# EAGLE design DeviceDIn8DOut8 (EAGLE 5.00)
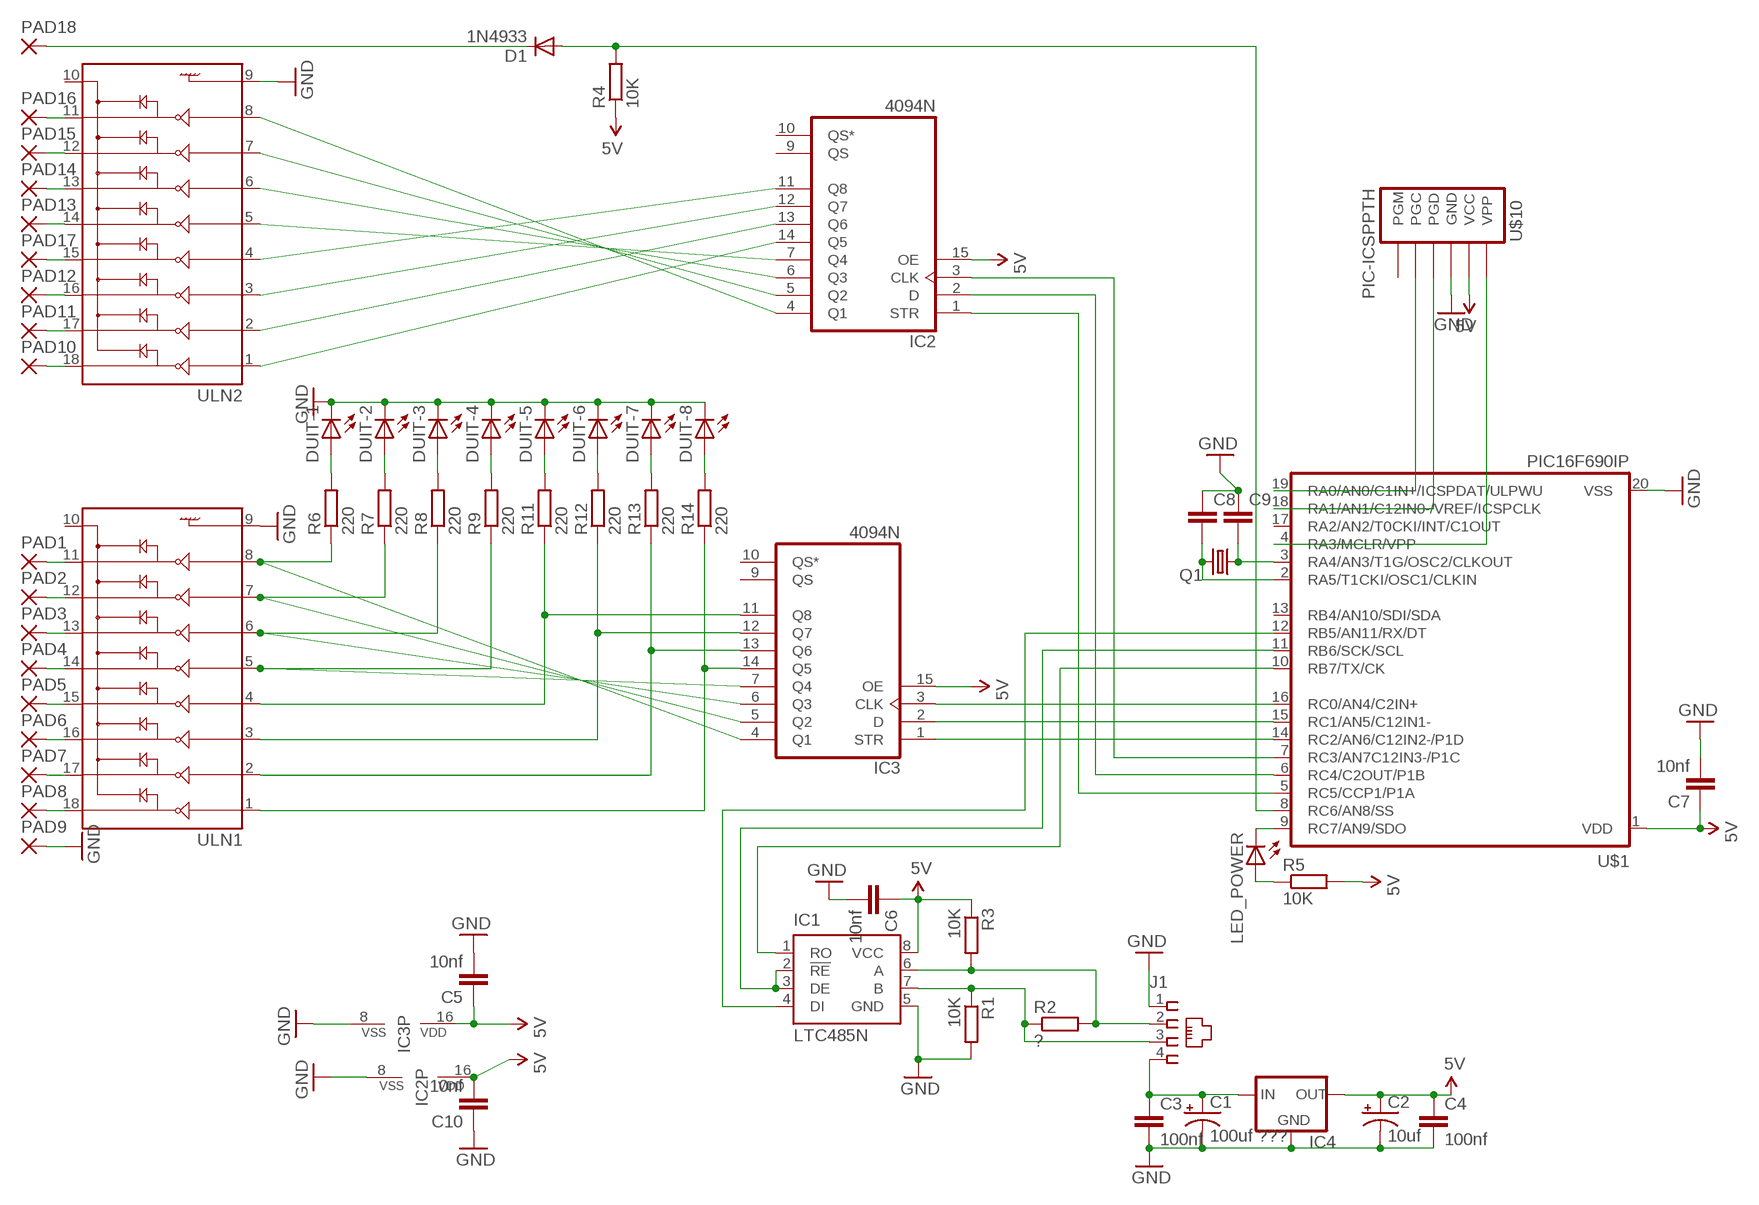
[diagram p0: schematic, sheet 1]

## Parts
C1  100uf ???  CAP_POLPTH1  [CPOL-RADIAL-100UF-25V]
C2  10uf  CAP_POLPTH1  [CPOL-RADIAL-100UF-25V]
C3  100nf  C2.5/2  [C2.5-2]
C4  100nf  C5/2.5  [C5B2.5]
C5  10nf  C5/3  [C5B3]
C6  10nf  C5/3  [C5B3]
C7  10nf  C2.5/2  [C2.5-2]
C8  C5/3  [C5B3]
C9  C5/3  [C5B3]
C10  10nf  C2.5/2  [C2.5-2]
D1  1N4933  [DO41-10]
DUIT-1  LED5MM  [LED5MM]
DUIT-2  LED5MM  [LED5MM]
DUIT-3  LED5MM  [LED5MM]
DUIT-4  LED5MM  [LED5MM]
DUIT-5  LED5MM  [LED5MM]
DUIT-6  LED5MM  [LED5MM]
DUIT-7  LED5MM  [LED5MM]
DUIT-8  LED5MM  [LED5MM]
IC1  LTC485N  [DIL08]
IC2  4094N  [DIL16]
IC3  4094N  [DIL16]
IC4  78XXS  [78XXS]
J1  215875-3  [215875-3]
LED_POWER  LED5MM  [LED5MM]
PAD1  2,15/1,0  [2,15/1,0]
PAD2  2,15/1,0  [2,15/1,0]
PAD3  2,15/1,0  [2,15/1,0]
PAD4  2,15/1,0  [2,15/1,0]
PAD5  2,15/1,0  [2,15/1,0]
PAD6  2,15/1,0  [2,15/1,0]
PAD7  2,15/1,0  [2,15/1,0]
PAD8  2,15/1,0  [2,15/1,0]
PAD9  2,15/1,0  [2,15/1,0]
PAD10  2,15/1,0  [2,15/1,0]
PAD11  2,15/1,0  [2,15/1,0]
PAD12  2,15/1,0  [2,15/1,0]
PAD13  2,15/1,0  [2,15/1,0]
PAD14  2,15/1,0  [2,15/1,0]
PAD15  2,15/1,0  [2,15/1,0]
PAD16  2,15/1,0  [2,15/1,0]
PAD17  2,15/1,0  [2,15/1,0]
PAD18  2,15/1,0  [2,15/1,0]
Q1  CRYSTALHC49S  [HC49/S]
R1  10K  R-EU_0204/5  [0204/5]
R2  ?  R-EU_0204/5  [0204/5]
R3  10K  R-EU_0204/5  [0204/5]
R4  10K  R-EU_0204/5  [0204/5]
R5  10K  R-EU_0204/5  [0204/5]
R6  220  R-EU_0204/7  [0204/7]
R7  220  R-EU_0204/7  [0204/7]
R8  220  R-EU_0204/7  [0204/7]
R9  220  R-EU_0204/7  [0204/7]
R11  220  R-EU_0204/7  [0204/7]
R12  220  R-EU_0204/7  [0204/7]
R13  220  R-EU_0204/7  [0204/7]
R14  220  R-EU_0204/7  [0204/7]
U$1  PIC16F690IP  [DIL20]
U$10  PIC-ICSPPTH  [MOLEX-1X6]
ULN1  ULN2803DIP  [DIL18]
ULN2  ULN2803DIP  [DIL18]

## Nets
5V: C2.1(+) C4.1 C5.1 C6.1 C7.1 C10.2 IC1.8(VCC) IC2.15(OE) IC2.16(VDD) IC3.15(OE) IC3.16(VDD) IC4.OUT R3.1 R4.1 R5.2 U$1.1(VDD) U$10.5(VCC)
GND: C1.2(-) C2.2(-) C3.2 C4.2 C5.2 C6.2 C7.2 C8.1 C9.1 C10.1 DUIT-1.K(C) DUIT-2.K(C) DUIT-3.K(C) DUIT-4.K(C) DUIT-5.K(C) DUIT-6.K(C) DUIT-7.K(C) DUIT-8.K(C) IC1.5(GND) IC2.8(VSS) IC3.8(VSS) IC4.GND J1.1 PAD9.1(P) R1.2 U$1.20(VSS) U$10.4(GND) ULN1.9 ULN2.9
N$1: PAD1.1(P) ULN1.11
N$2: PAD2.1(P) ULN1.12
N$3: PAD3.1(P) ULN1.13
N$4: PAD4.1(P) ULN1.14
N$5: PAD5.1(P) ULN1.15
N$6: PAD6.1(P) ULN1.16
N$7: PAD8.1(P) ULN1.18
N$8: PAD7.1(P) ULN1.17
N$9: D1.A R4.2 U$1.8(RC6/AN8/SS)
N$10: IC3.7(Q4) R9.1 ULN1.5
N$11: IC1.6(A) J1.2 R2.2 R3.2
N$12: IC3.6(Q3) R8.1 ULN1.6
N$13: IC3.5(Q2) R7.1 ULN1.7
N$14: IC3.4(Q1) R6.1 ULN1.8
N$15: IC3.14(Q5) R14.1 ULN1.1
N$16: IC3.13(Q6) R13.1 ULN1.2
N$17: IC3.12(Q7) R12.1 ULN1.3
N$18: IC3.11(Q8) R11.1 ULN1.4
N$19: IC2.3(CLK) U$1.7(RC3/AN7C12IN3-/P1C)
N$20: IC2.2(D) U$1.6(RC4/C2OUT/P1B)
N$21: IC2.1(STR) U$1.5(RC5/CCP1/P1A)
N$23: IC2.14(Q5) ULN2.1
N$24: IC2.13(Q6) ULN2.2
N$25: IC1.2(!RE) IC1.3(DE) U$1.11(RB6/SCK/SCL)
N$26: IC2.12(Q7) ULN2.3
N$27: IC2.11(Q8) ULN2.4
N$28: IC2.7(Q4) ULN2.5
N$29: IC2.6(Q3) ULN2.6
N$30: IC2.5(Q2) ULN2.7
N$31: IC2.4(Q1) ULN2.8
N$32: D1.C PAD18.1(P)
N$33: PAD11.1(P) ULN2.17
N$34: PAD16.1(P) ULN2.11
N$35: PAD15.1(P) ULN2.12
N$36: PAD14.1(P) ULN2.13
N$37: PAD13.1(P) ULN2.14
N$38: PAD17.1(P) ULN2.15
N$39: PAD12.1(P) ULN2.16
N$40: PAD10.1(P) ULN2.18
N$41: LED_POWER.K(C) U$1.9(RC7/AN9/SDO)
N$42: LED_POWER.A R5.1
N$43: DUIT-4.A R9.2
N$44: DUIT-5.A R11.2
N$45: DUIT-1.A R6.2
N$46: C1.1(+) C3.1 IC4.IN J1.4
N$47: IC3.2(D) U$1.15(RC1/AN5/C12IN1-)
N$48: IC3.1(STR) U$1.14(RC2/AN6/C12IN2-/P1D)
N$49: IC1.4(DI) U$1.12(RB5/AN11/RX/DT)
N$50: IC1.7(B) J1.3 R1.1 R2.1
N$51: IC1.1(RO) U$1.10(RB7/TX/CK)
N$52: C8.2 Q1.2 U$1.2(RA5/T1CKI/OSC1/CLKIN)
N$53: C9.2 Q1.1 U$1.3(RA4/AN3/T1G/OSC2/CLKOUT)
N$55: DUIT-2.A R7.2
N$56: DUIT-3.A R8.2
N$57: DUIT-6.A R12.2
N$58: DUIT-7.A R13.2
N$59: DUIT-8.A R14.2
N$60: IC3.3(CLK) U$1.16(RC0/AN4/C2IN+)
N$61: U$1.4(RA3/MCLR/VPP) U$10.6(VPP)
N$62: U$1.18(RA1/AN1/C12IN0-/VREF/ICSPCLK) U$10.3(PGD)
N$63: U$1.19(RA0/AN0/C1IN+/ICSPDAT/ULPWU) U$10.2(PGC)
Unconnected: IC2.9(QS) IC2.10(QS*) IC3.9(QS) IC3.10(QS*) U$1.13(RB4/AN10/SDI/SDA) U$1.17(RA2/AN2/T0CKI/INT/C1OUT) U$10.1(PGM) ULN1.10 ULN2.10

## Library data of the parts
C1 C2 = SparkFun:CAP_POL: Capacitor Polarized These are standard SMD and PTH capacitors. Normally 10uF, 47uF, and 100uF in electrolytic and tantalum varieties. Always verify the external diameter of the through hole cap, it varies with capacity, voltage, and manufacturer. The EIA devices should be standard.
C3-C10 = capacitor-wima:C: CAPACITOR naming: grid - package width
D1 = diode:1N4933: DIODE fast recovery rectifier, 1A
DUIT-1-DUIT-8 LED_POWER = led:LED: LED OSRAM: - CHIPLED LG R971, LG N971, LY N971, LG Q971, LY Q971, LO R971, LY R971 LH N974, LH R974 LS Q976, LO Q976, LY Q976 LO Q996 - Hyper CHIPLED LW Q18S LB Q993, LB Q99A, LB R99A - SideLED LS A670, LO A670, LY A670, LG A670, LP A670 LB A673, LV A673, LT A673, LW A673 LH A674 LY A675 LS A676, LA A676, LO A676, LY A676, LW A676 LS A679, LY A679, LG A679 - Hyper Micro SIDELED® LS Y876, LA Y876, LO Y876, LY Y876 LT Y87S - SmartLED LW L88C, LW L88S LB L89C, LB L89S, LG L890 LS L89K, LO L89K, LY L89K LS L896, LA L896, LO L896, LY L896 - TOPLED LS T670, LO T670, LY T670, LG T670, LP T670 LSG T670, LSP T670, LSY T670, LOP T670, LYG T670 LG T671, LOG T671, LSG T671 LB T673, LV T673, LT T673, LW T673 LH T674 LS T676, LA T676, LO T676, LY T676, LB T676, LH T676, LSB T676, LW T676 LB T67C, LV T67C, LT T67C, LS T67K, LO T67K, LY T67K, LW E67C LS E67B, LA E67B, LO E67B, LY E67B, LB E67C, LV E67C, LT E67C LW T67C LS T679, LY T679, LG T679 LS T770, LO T770, LY T770, LG T770, LP T770 LB T773, LV T773, LT T773, LW T773 LH T774 LS E675, LA E675, LY E675, LS T675 LS T776, LA T776, LO T776, LY T776, LB T776 LHGB T686 LT T68C, LB T68C - Hyper Mini TOPLED® LB M676 - Mini TOPLED Santana® LG M470 LS M47K, LO M47K, LY M47K Source: http://www.osram.convergy.de LUXEON: - LUMILED® LXK2-PW12-R00, LXK2-PW12-S00, LXK2-PW14-U00, LXK2-PW14-V00 LXK2-PM12-R00, LXK2-PM12-S00, LXK2-PM14-U00 LXK2-PE12-Q00, LXK2-PE12-R00, LXK2-PE12-S00, LXK2-PE14-T00, LXK2-PE14-U00 LXK2-PB12-K00, LXK2-PB12-L00, LXK2-PB12-M00, LXK2-PB14-N00, LXK2-PB14-P00, LXK2-PB14-Q00 LXK2-PR12-L00, LXK2-PR12-M00, LXK2-PR14-Q00, LXK2-PR14-R00 LXK2-PD12-Q00, LXK2-PD12-R00, LXK2-PD12-S00 LXK2-PH12-R00, LXK2-PH12-S00 LXK2-PL12-P00, LXK2-PL12-Q00, LXK2-PL12-R00 Source: www.luxeon.com KINGBRIGHT: KA-3528ASYC Source: www.kingbright.com
IC1 = linear-technology:LTC485: Low Power RS485 Interface Transceiver Source: http://www.linear.com/pc/downloadDocument.do?navId=H0,C1,C1007,C1017,P2064,D1718
IC2 IC3 = 40xx:4094: 8-stage SHIFT/STORE REGISTER, tri-state
IC4 = v-reg:78XXS: VOLTAGE REGULATOR
J1 = con-amp:215875-3: AMP connector
PAD1-PAD18 = wirepad:2,15/1,0: THROUGH-HOLE PAD
Q1 = crystal:CRYSTAL: CRYSTAL
R1-R5 = resistor:R-EU_: RESISTOR, European symbol
R6-R9 R11-R14 = rcl:R-EU_: RESISTOR, European symbol
U$1 = microchip-5:PIC16F690*: MICROCONTROLLER PIC16F690 18 I/O One 16-bit timer Two 8-bit timer Two comparators Precision internal oscillator-software selectable 8 MHz - 32 KHz SSP w/ I2C Compatible Address mask option EUSART LIN 2.0 Compatible ECCP+ w/ PWM Steering 12 A/D Channels ULPW Enhanced Low Power Timer 1 Timer 1 Gate Synch Latch 4k Program Flash memory 256 bytes SRAM 256 bytes EEPROM
U$10 = SparkFun:PIC-ICSP: ISCP Programming connector for UAV, UBW Kit, etc.
ULN1 ULN2 = SparkFun:ULN2803: Darlington Driver ULN2803 Darlington array. 500mA max per channel, 8-channel package. Spark Fun Electronics SKU : COM-00312

## Board
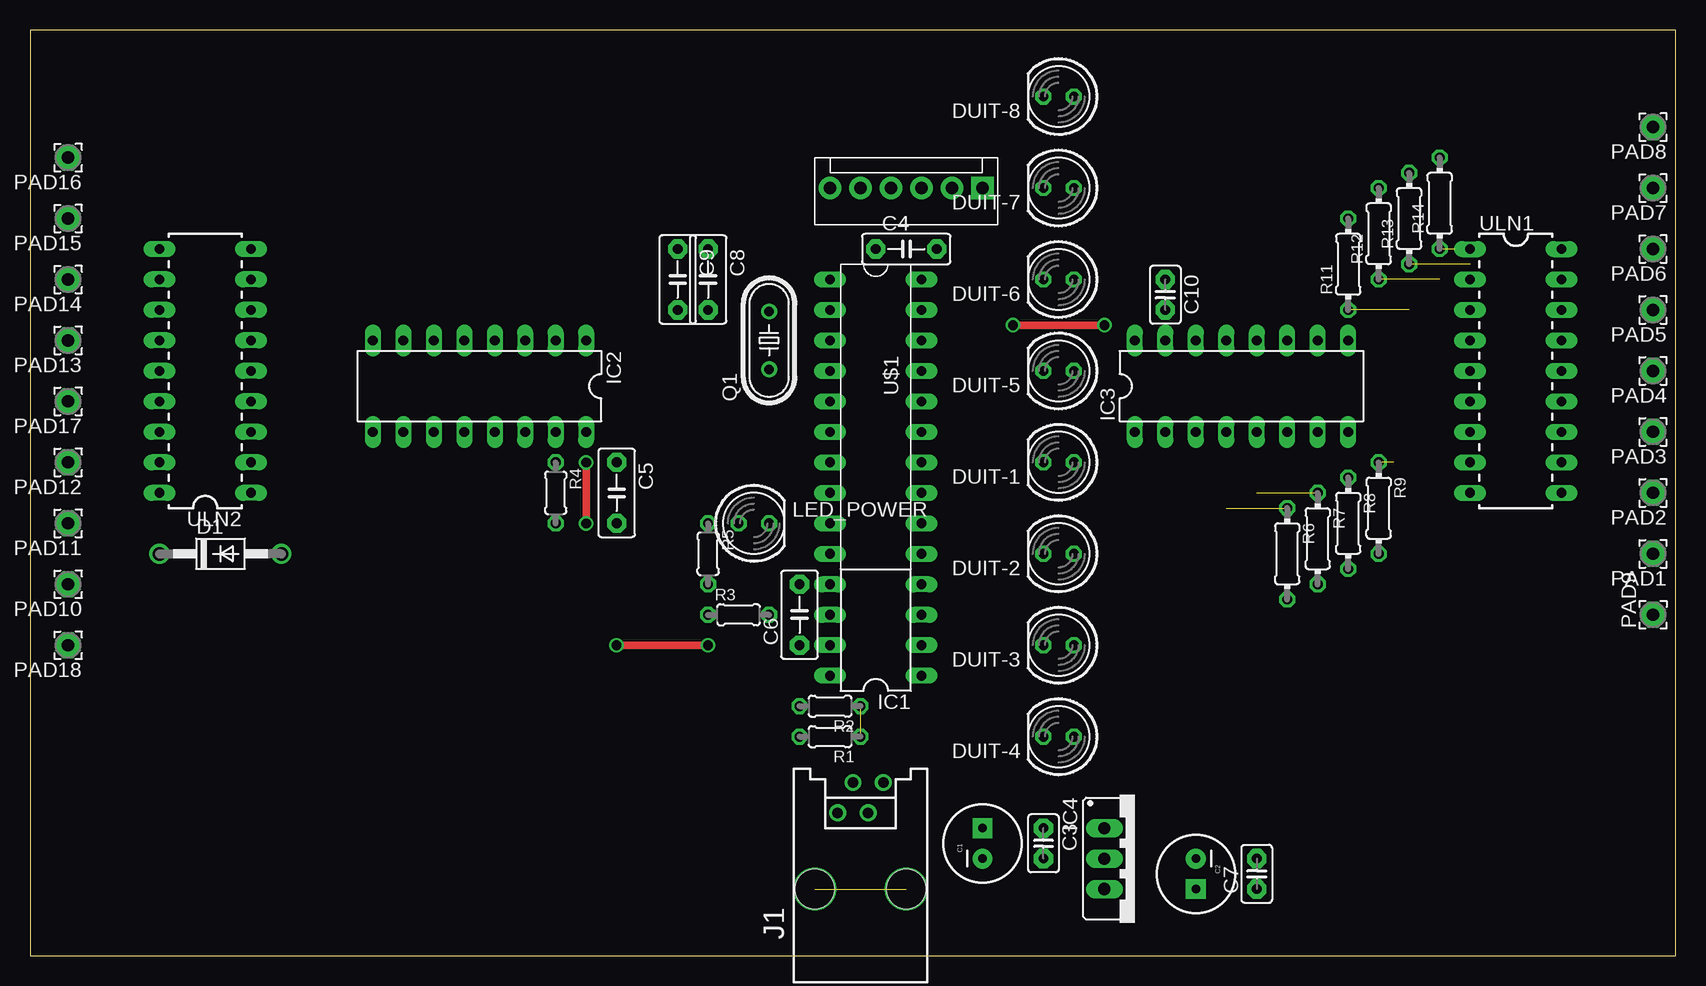
[diagram p1: board, top side]
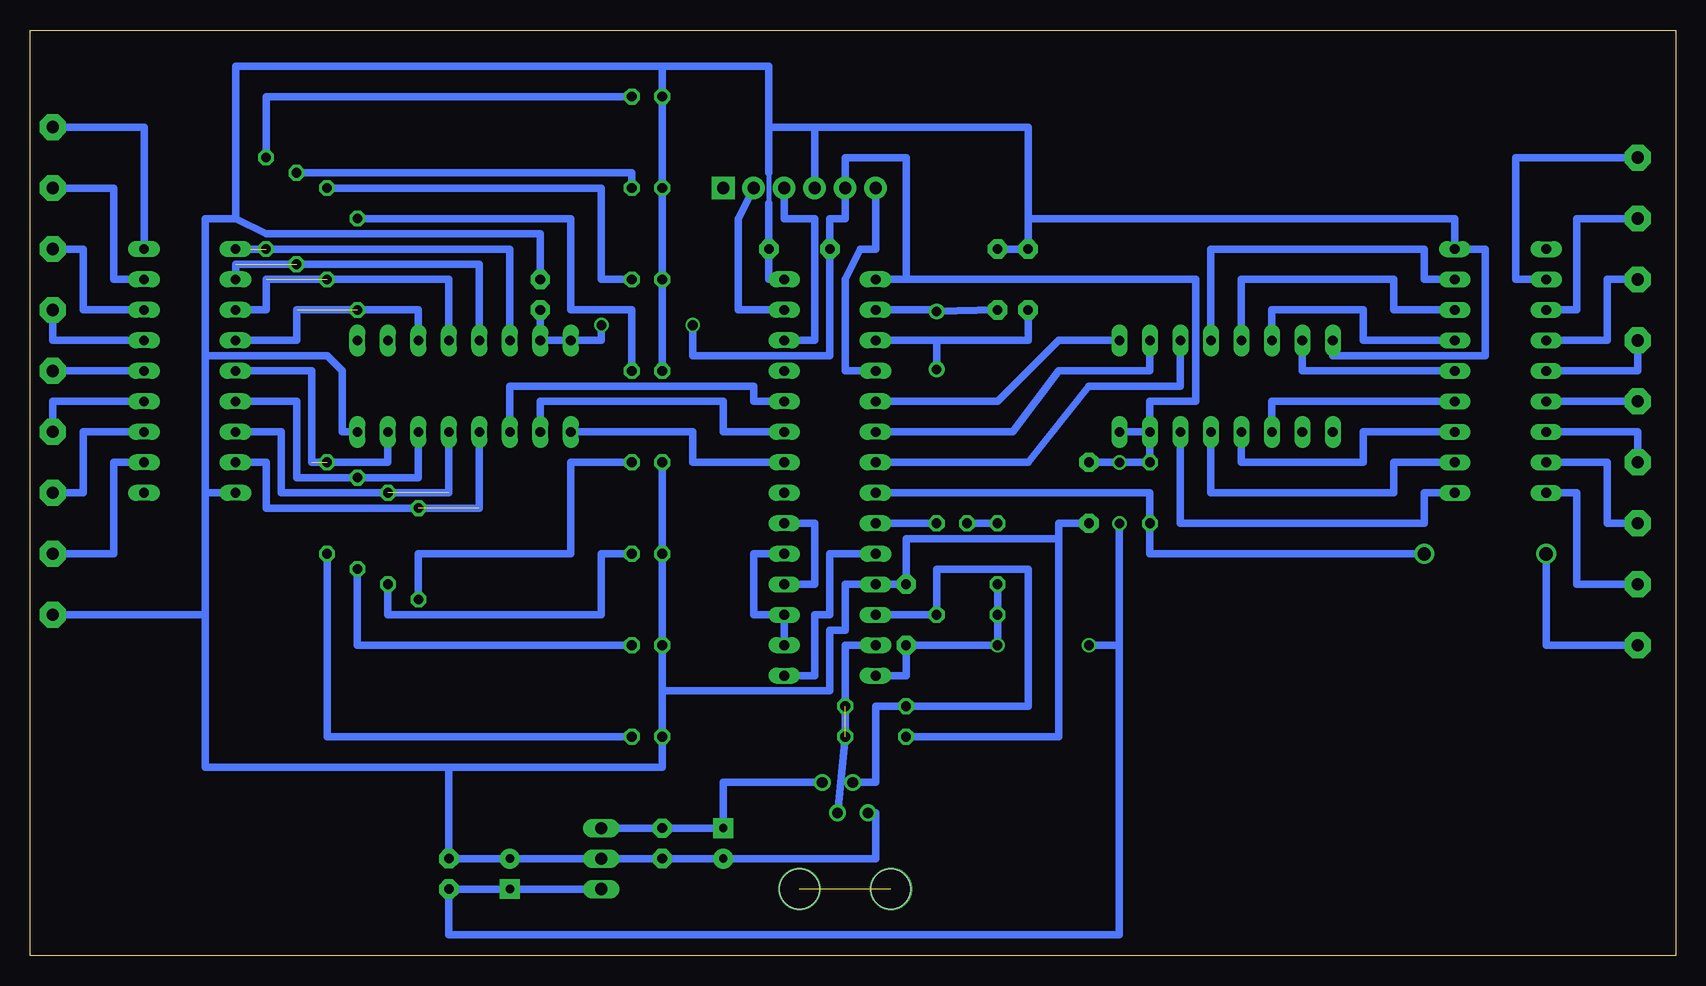
[diagram p2: board, bottom side, seen from below]

Size 137.14 x 77.14 mm. Coordinates in mm from the lower left corner, seen from the top.
Outline: 0,0 137.14,0 137.14,77.14 0,77.14 0,0
Copper layers (1*16): Top 0.035mm / dielectric 1.5mm / Bottom 0.035mm
Design rules "default": minimum track width 10mil, minimum drill 24mil, track to track 8mil, track to pad 8mil, pad to pad 8mil, via to via 8mil, smd to smd 8mil, copper to edge 40mil, drill to drill 8mil, minimum pad ring 10mil, minimum via ring 8mil, stop-mask expansion 4mil, vias tented up to drill 0mil, thermal gap 10mil

### Footprints (pad centres in the part's own frame; a part is rotated, then mirrored left to right if it is on the bottom)
CPOL-RADIAL-100UF-25V = drill 0.7 pad 1.651 square: 1 1.27,0 | drill 0.7 pad 1.651 round: 2 -1.27,0
C2.5-2 = drill 0.813 pad 1.6 octagon: 1 -1.27,0; 2 1.27,0
C5B2.5 = drill 0.813 pad 1.6 octagon: 1 -2.54,0; 2 2.54,0
C5B3 = drill 0.813 pad 1.6 octagon: 1 -2.54,0; 2 2.54,0
DO41-10 = drill 1.118 round: A 5.08,0; C -5.08,0
LED5MM = drill 0.813 octagon: A -1.27,0; K 1.27,0
DIL08 = drill 0.813 long: 1 -3.81,-3.81; 2 -1.27,-3.81; 3 1.27,-3.81; 4 3.81,-3.81; 5 3.81,3.81; 6 1.27,3.81; 7 -1.27,3.81; 8 -3.81,3.81
DIL16 = drill 0.813 long: 1 -8.89,-3.81; 2 -6.35,-3.81; 3 -3.81,-3.81; 4 -1.27,-3.81; 5 1.27,-3.81; 6 3.81,-3.81; 7 6.35,-3.81; 8 8.89,-3.81; 9 8.89,3.81; 10 6.35,3.81; 11 3.81,3.81; 12 1.27,3.81; 13 -1.27,3.81; 14 -3.81,3.81; 15 -6.35,3.81; 16 -8.89,3.81
78XXS = drill 1.016 long: GND 0,-2.54; IN -2.54,-2.54; OUT 2.54,-2.54
215875-3 = drill 0.889 round: 1 -1.905,6.35; 2 -0.635,8.89; 3 0.635,6.35; 4 1.905,8.89 | hole 3.251: -3.81,0; 3.81,0
2,15/1,0 = drill 1.016 pad 2.159 octagon: 1 0,0
HC49/S = drill 0.813 round: 1 -2.413,0; 2 2.413,0
0204/5 = drill 0.813 octagon: 1 -2.54,0; 2 2.54,0
0204/7 = drill 0.813 octagon: 1 -3.81,0; 2 3.81,0
DIL20 = drill 0.813 long: 1 -11.43,-3.81; 2 -8.89,-3.81; 3 -6.35,-3.81; 4 -3.81,-3.81; 5 -1.27,-3.81; 6 1.27,-3.81; 7 3.81,-3.81; 8 6.35,-3.81; 9 8.89,-3.81; 10 11.43,-3.81; 11 11.43,3.81; 12 8.89,3.81; 13 6.35,3.81; 14 3.81,3.81; 15 1.27,3.81; 16 -1.27,3.81; 17 -3.81,3.81; 18 -6.35,3.81; 19 -8.89,3.81; 20 -11.43,3.81
MOLEX-1X6 = drill 1.016 pad 1.88 square: 1 0,0 | drill 1.016 pad 1.88 round: 2 2.54,0; 3 5.08,0; 4 7.62,0; 5 10.16,0; 6 12.7,0
DIL18 = drill 0.813 long: 1 -10.16,-3.81; 2 -7.62,-3.81; 3 -5.08,-3.81; 4 -2.54,-3.81; 5 0,-3.81; 6 2.54,-3.81; 7 5.08,-3.81; 8 7.62,-3.81; 9 10.16,-3.81; 10 10.16,3.81; 11 7.62,3.81; 12 5.08,3.81; 13 2.54,3.81; 14 0,3.81; 15 -2.54,3.81; 16 -5.08,3.81; 17 -7.62,3.81; 18 -10.16,3.81

### Placement (x,y rotation side)
C1  79.37,9.36 90 top
C2  97.15,6.82 270 top
C3  84.45,9.36 270 top
C4  73.02,58.89 0 top
C5  48.89,38.57 270 top
C6  64.13,28.41 90 top
C7  102.23,6.82 90 top
C8  22pf  [C5B3]  56.51,56.35 270 top
C9  22pf  [C5B3]  53.97,56.35 270 top
C10  94.61,55.08 270 top
D1  15.87,33.49 0 top
DUIT-1  85.72,41.11 180 top
DUIT-2  85.72,33.49 180 top
DUIT-3  85.72,25.87 180 top
DUIT-4  85.72,18.25 180 top
DUIT-5  85.72,48.73 180 top
DUIT-6  85.72,56.35 180 top
DUIT-7  85.72,63.97 180 top
DUIT-8  85.72,71.59 180 top
IC1  70.48,27.14 90 top
IC2  37.46,47.46 180 top
IC3  100.96,47.46 0 top
IC4  92.07,8.09 270 top
J1  69.21,5.55 0 top
LED_POWER  60.32,36.03 0 top
PAD1  135.25,33.49 180 top
PAD2  135.25,38.57 180 top
PAD3  135.25,43.65 180 top
PAD4  135.25,48.73 180 top
PAD5  135.25,53.81 180 top
PAD6  135.25,58.89 180 top
PAD7  135.25,63.97 180 top
PAD8  135.25,69.05 180 top
PAD9  135.25,28.41 90 top
PAD10  3.17,30.95 180 top
PAD11  3.17,36.03 180 top
PAD12  3.17,41.11 180 top
PAD13  3.17,51.27 180 top
PAD14  3.17,56.35 180 top
PAD15  3.17,61.43 180 top
PAD16  3.17,66.51 180 top
PAD17  3.17,46.19 180 top
PAD18  3.17,25.87 180 top
Q1  12MHz  [HC49/S]  61.59,51.27 90 top
R1  66.67,18.25 180 top
R2  66.67,20.79 180 top
R3  59.05,28.41 0 top
R4  43.81,38.57 270 top
R5  56.51,33.49 270 top
R6  104.77,33.49 270 top
R7  107.31,34.76 270 top
R8  109.85,36.03 270 top
R9  112.39,37.3 270 top
R11  109.85,57.62 90 top
R12  112.39,60.16 90 top
R13  114.93,61.43 90 top
R14  117.47,62.7 90 top
U$1  70.48,44.92 270 top
U$10  79.37,63.97 180 top
ULN1  123.82,48.73 270 top
ULN2  14.6,48.73 90 top

### Tracks (layer width: path | path; a pad name or v marks a point on that pad's centre or on a via)
5V  (via drill 0.8)
  Top 0.61: v48.89,25.87 v56.51,25.87 | v46.35,36.03 v46.35,41.11 | v81.91,52.54 v89.53,52.54
  Bottom 0.254: IC3.16 IC3.15
  Bottom 0.61: C10.2 IC3.15 IC3.16 89.53,51.27 v89.53,52.54 | IC2.15 IC2.16 IC2.15 | R5.2 R3.1 v56.51,25.87 C6.1 64.13,23.33 IC1.8 | IC2.15 R4.1 v46.35,41.11 C5.1 | IC4.OUT C2.1 C7.1 102.23,1.74 46.35,1.74 46.35,25.87 | IC2.15 43.81,46.19 40,46.19 40,56.35 64.13,56.35 | 64.13,56.35 U$1.1 | 46.35,25.87 v48.89,25.87 | 46.35,25.87 v46.35,36.03 | 64.13,56.35 64.13,66.51 69.21,66.51 U$10.5 69.21,61.43 70.48,61.43 C4.1 70.48,50 81.91,50 v81.91,52.54
GND
  Bottom 0.406: 75.56,65.24 75.56,62.7
  Bottom 0.61: IC3.8 111.12,43.65 111.12,48.73 112.39,50 122.55,50 122.55,48.73 | 122.55,48.73 122.55,38.57 | 122.55,38.57 ULN1.9 | DUIT-8.K DUIT-7.K DUIT-6.K DUIT-5.K 84.45,74.13 | C10.1 94.61,60.16 117.47,60.16 120.01,61.43 | 120.01,61.43 122.55,61.43 122.55,48.73 | 84.45,22.06 DUIT-4.K 84.45,15.71 | 84.45,22.06 DUIT-3.K DUIT-2.K DUIT-1.K 84.45,22.06 | 71.75,69.05 75.56,69.05 | C8.1 C9.1 53.97,61.43 | 122.55,28.41 PAD9.1 | 122.55,38.57 122.55,28.41 | 53.97,61.43 18.41,61.43 ULN2.9 15.87,58.89 15.87,50 28.57,50 IC2.8 | 84.45,74.13 75.56,74.13 75.56,69.05 | 84.45,74.13 120.01,74.13 120.01,61.43 | 71.75,69.05 U$10.4 | 71.75,69.05 53.97,69.05 53.97,61.43 | J1.1 66.67,11.9 66.67,8.09 C1.2 C3.2 IC4.GND C2.2 C7.2 102.23,15.71 84.45,15.71 | R1.2 51.43,18.25 51.43,36.03 | 51.43,36.03 51.43,34.76 64.13,34.76 C6.2 IC1.5 69.21,30.95 69.21,27.14 70.48,27.14 70.48,22.06 84.45,22.06 | 84.45,15.71 84.45,22.06 | 84.45,15.71 122.55,15.71 122.55,28.41 | 51.43,36.03 C5.2 | U$1.20 75.56,56.35 C4.2 75.56,62.7 | 75.56,69.05 75.56,65.24
N$1
  Bottom 0.61: ULN1.11 130.17,41.11 130.17,33.49 PAD1.1
N$2
  Bottom 0.61: PAD2.1 132.71,38.57 132.71,43.65 ULN1.12
N$3
  Bottom 0.61: PAD3.1 135.25,46.19 ULN1.13
N$4
  Bottom 0.61: ULN1.14 PAD4.1
N$5
  Bottom 0.61: PAD5.1 135.25,51.27 ULN1.15
N$6
  Bottom 0.61: PAD6.1 132.71,58.89 132.71,53.81 ULN1.16
N$7
  Bottom 0.61: PAD8.1 127.63,69.05 ULN1.18
N$8
  Bottom 0.61: PAD7.1 130.17,63.97 130.17,56.35 ULN1.17
N$9
  Bottom 0.61: D1.A 43.81,33.49 R4.2 43.81,38.57 U$1.8
N$10  (1 unrouted)
  Bottom 0.61: ULN1.5 113.66,48.73 113.66,41.11 107.31,41.11 IC3.7
N$11
  Bottom 0.61: IC1.6 R3.2 61.59,32.22 53.97,32.22 53.97,20.79 R2.2 66.67,20.79 66.67,14.44 J1.2
N$12
  Bottom 0.61: ULN1.6 114.93,46.19 114.93,39.84 R8.1 104.77,39.84 IC3.6
N$13  (1 unrouted)
  Bottom 0.61: ULN1.7 116.2,43.65 116.2,38.57 102.23,38.57 IC3.5
N$14  (1 unrouted)
  Bottom 0.61: ULN1.8 117.47,41.11 117.47,37.3 99.69,37.3 IC3.4
N$15  (1 unrouted)
  Bottom 0.61: ULN1.1 118.74,58.89 97.15,58.89 IC3.14
N$16  (1 unrouted)
  Bottom 0.61: IC3.13 99.69,57.62 120.01,57.62 ULN1.2
N$17  (1 unrouted)
  Bottom 0.61: IC3.12 102.23,56.35 117.47,56.35 117.47,53.81 ULN1.3
N$18  (1 unrouted)
  Bottom 0.61: IC3.11 104.77,53.81 114.93,53.81 114.93,51.27 ULN1.4
N$19
  Bottom 0.61: U$1.7 53.97,41.11 48.89,47.46 41.27,47.46 IC2.3
N$20
  Bottom 0.61: IC2.2 43.81,48.73 51.43,48.73 55.24,43.65 U$1.6
N$21
  Bottom 0.61: U$1.5 56.51,46.19 51.43,51.27 IC2.1
N$23
  Bottom 0.61: ULN2.1 20.95,38.57 20.95,36.03 41.27,36.03 IC2.14
N$24
  Bottom 0.61: ULN2.2 23.49,41.11 23.49,38.57 38.73,38.57 IC2.13
N$25
  Bottom 0.61: U$1.11 76.83,33.49 76.83,28.41 IC1.3 IC1.2
N$26
  Bottom 0.61: ULN2.3 26.03,43.65 26.03,41.11 36.19,41.11 IC2.12
N$27
  Bottom 0.61: ULN2.4 33.65,46.19 IC2.11
N$28
  Bottom 0.61: ULN2.5 31.11,48.73 IC2.7
N$29
  Bottom 0.61: ULN2.6 26.03,51.27 26.03,53.81 33.65,53.81 IC2.6
N$30
  Bottom 0.61: ULN2.7 23.49,53.81 23.49,56.35 36.19,56.35 IC2.5
N$31
  Bottom 0.61: ULN2.8 20.95,56.35 20.95,58.89 38.73,58.89 IC2.4
N$32
  Bottom 0.61: PAD18.1 10.79,25.87 D1.C
N$33
  Bottom 0.61: ULN2.17 5.71,41.11 5.71,36.03 PAD11.1
N$34
  Bottom 0.61: PAD16.1 13.33,66.51 13.33,56.35 ULN2.11
N$35
  Bottom 0.61: ULN2.12 8.25,53.81 8.25,61.43 PAD15.1
N$36
  Bottom 0.61: ULN2.13 5.71,51.27 5.71,56.35 PAD14.1
N$37
  Bottom 0.61: ULN2.14 3.17,48.73 PAD13.1
N$38
  Bottom 0.61: PAD17.1 ULN2.15
N$39
  Bottom 0.61: ULN2.16 3.17,43.65 PAD12.1
N$40
  Bottom 0.61: ULN2.18 8.25,38.57 8.25,30.95 PAD10.1
N$41
  Bottom 0.61: LED_POWER.K U$1.9
N$42
  Bottom 0.61: R5.1 LED_POWER.A
N$43
  Bottom 0.61: R9.2 112.39,18.25 DUIT-4.A
N$44
  Bottom 0.61: R11.2 92.07,61.43 92.07,53.81 86.99,53.81 DUIT-5.A
N$45
  Bottom 0.61: R6.2 104.77,33.49 92.07,33.49 92.07,41.11 DUIT-1.A
N$46
  Bottom 0.61: J1.4 79.37,14.44 C1.1 C3.1 IC4.IN
N$47
  Bottom 0.61: IC3.2 94.61,46.19 79.37,46.19 79.37,43.65 U$1.15
N$48
  Bottom 0.61: 89.53,43.65 IC3.1 81.91,43.65 81.91,41.11 U$1.14
N$49
  Bottom 0.61: U$1.12 71.75,36.03 71.75,30.95 IC1.4
N$50  (1 unrouted)
  Bottom 0.61: J1.3 R1.1 69.21,25.87 IC1.7
N$51
  Bottom 0.61: IC1.1 71.75,23.33 71.75,28.41 70.48,28.41 70.48,33.49 U$1.10
N$52
  Bottom 0.61: U$1.2 61.59,53.81 Q1.2 C8.2
N$53
  Bottom 0.61: 61.59,48.73 Q1.1 61.59,51.27 | C9.2 53.97,51.27 61.59,51.27 | 61.59,51.27 U$1.3
N$54  (via drill 2.54 pad 1.68)  (1 unrouted)
  other vias: 65.4,5.55 73.02,5.55
N$55
  Bottom 0.61: R7.2 107.31,28.41 89.53,28.41 89.53,33.49 DUIT-2.A
N$56
  Bottom 0.61: R8.2 109.85,25.87 DUIT-3.A
N$57
  Bottom 0.61: R12.2 89.53,63.97 89.53,56.35 DUIT-6.A
N$58
  Bottom 0.61: DUIT-7.A 86.99,65.24 R13.2
N$59
  Bottom 0.61: R14.2 117.47,71.59 DUIT-8.A
N$60
  Bottom 0.61: IC3.3 97.15,47.46 76.83,47.46 76.83,46.19 U$1.16
N$61
  Bottom 0.61: U$1.4 69.21,48.73 69.21,56.35 67.94,58.89 66.67,58.89 U$10.6
N$62
  Bottom 0.61: U$10.3 74.29,61.43 71.75,61.43 71.75,51.27 U$1.18
N$63
  Bottom 0.61: U$10.2 78.1,61.43 78.1,53.81 U$1.19